# Altium schematic sheet Sheet3.SchDoc
size A3
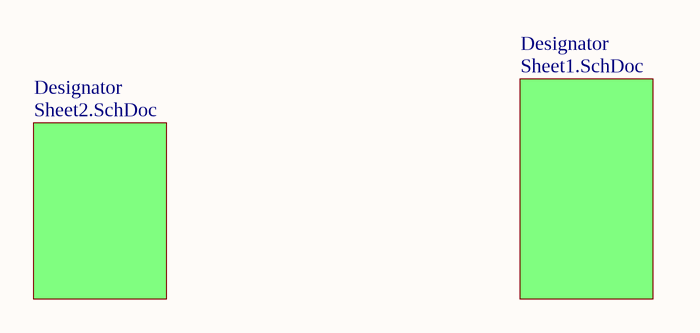
[diagram p0: Sheet3.SchDoc]

## Sub-sheets
Designator = Sheet2.SchDoc: no entries
Designator = Sheet1.SchDoc: no entries